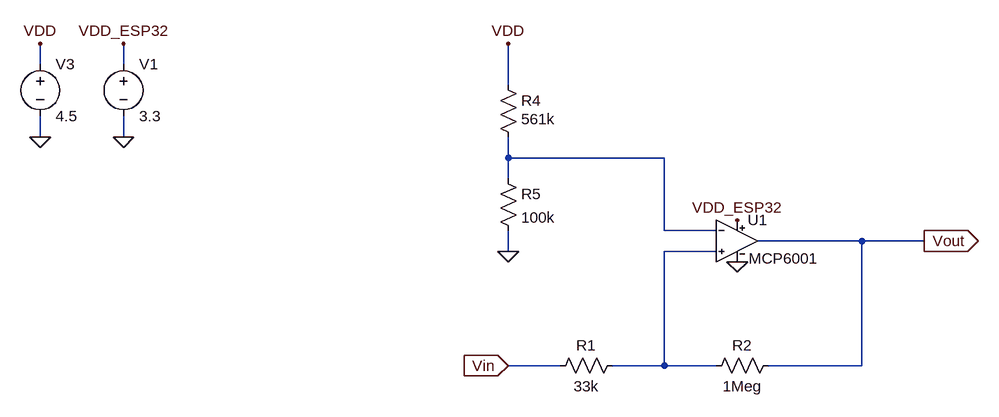
[diagram p0: schematic comparator.asc]
comparator.asc, the LTspice schematic file:
Version 4
SHEET 1 912 680
WIRE -560 -208 -560 -240
WIRE -432 -208 -432 -240
WIRE 160 -176 160 -240
WIRE -560 -96 -560 -128
WIRE -432 -96 -432 -128
WIRE 160 -64 160 -96
WIRE 400 -64 160 -64
WIRE 160 -32 160 -64
WIRE 400 48 400 -64
WIRE 480 48 400 48
WIRE 704 64 544 64
WIRE 800 64 704 64
WIRE 160 80 160 48
WIRE 480 80 400 80
WIRE 240 256 160 256
WIRE 400 256 400 80
WIRE 400 256 320 256
WIRE 480 256 400 256
WIRE 704 256 704 64
WIRE 704 256 560 256
FLAG 160 80 0
FLAG 512 96 0
FLAG 160 -240 VDD
FLAG 512 32 VDD_ESP32
FLAG -432 -96 0
FLAG 160 256 Vin
IOPIN 160 256 In
FLAG -432 -240 VDD_ESP32
FLAG 800 64 Vout
IOPIN 800 64 Out
FLAG -560 -96 0
FLAG -560 -240 VDD
SYMBOL res 336 240 R90
WINDOW 0 0 56 VBottom 2
WINDOW 3 32 56 VTop 2
SYMATTR InstName R1
SYMATTR Value 33k
SYMBOL MCP6001_AB 512 0 R0
SYMATTR InstName U1
SYMBOL res 576 240 R90
WINDOW 0 0 56 VBottom 2
WINDOW 3 32 56 VTop 2
SYMATTR InstName R2
SYMATTR Value 1Meg
SYMBOL res 144 -192 R0
WINDOW 3 36 68 Left 2
SYMATTR Value 561k
SYMATTR InstName R4
SYMBOL res 144 -48 R0
SYMATTR InstName R5
SYMATTR Value 100k
SYMBOL voltage -432 -224 R0
WINDOW 123 0 0 Left 0
WINDOW 39 0 0 Left 0
SYMATTR InstName V1
SYMATTR Value 3.3
SYMBOL voltage -560 -224 R0
WINDOW 123 0 0 Left 0
WINDOW 39 0 0 Left 0
SYMATTR InstName V3
SYMATTR Value 4.5

The netlist it stands for:
* comparator.asc
R1 N002 Vin 33k
XU1 N002 N001 VDD_ESP32 0 Vout MCP6001  ; pins In+ In- V+ V- OUT
R2 Vout N002 1Meg
R4 VDD N001 561k
R5 N001 0 100k
V1 VDD_ESP32 0 3.3
V3 VDD 0 4.5
.lib MCP6001.lib
.backanno
.end